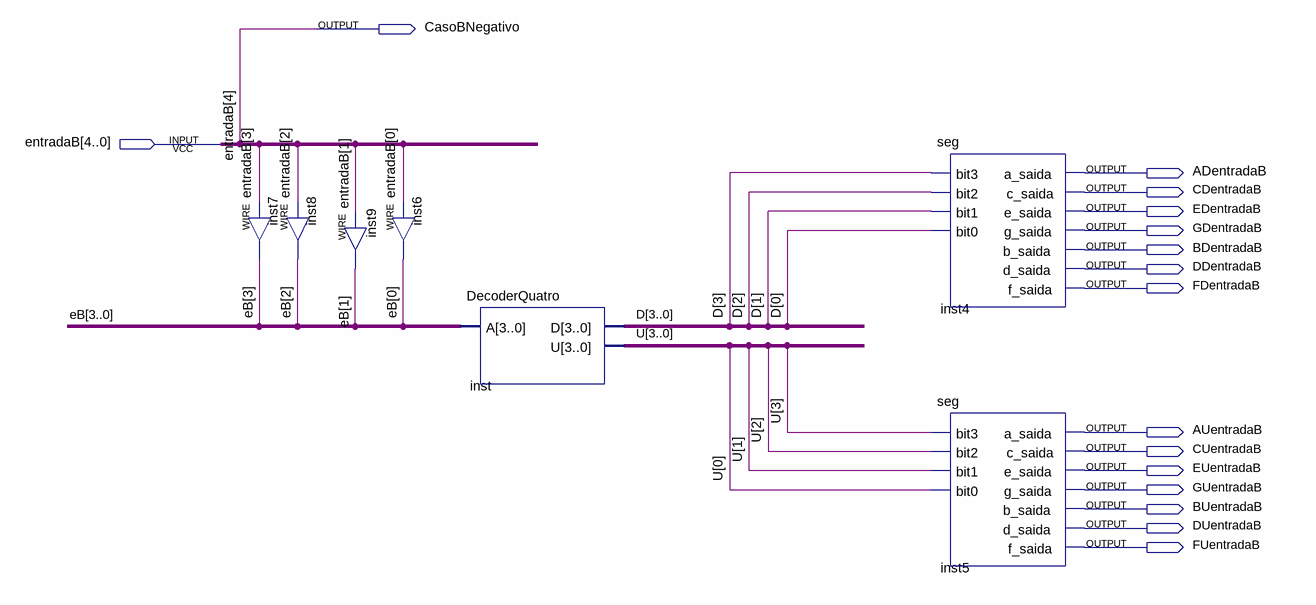
[diagram p0: schematic sheet]
// Quartus schematic EntradaB.bdf as structural Verilog: 7 symbols, 16 pins
module EntradaB (
  input  [4:0] entradaB,
  output CasoBNegativo,
  output ADentradaB,
  output CDentradaB,
  output EDentradaB,
  output GDentradaB,
  output BDentradaB,
  output DDentradaB,
  output FDentradaB,
  output AUentradaB,
  output CUentradaB,
  output EUentradaB,
  output GUentradaB,
  output BUentradaB,
  output DUentradaB,
  output FUentradaB
);

  wire [3:0] D, eB, U;

  assign eB[3] = entradaB[3];  // WIRE inst7
  assign eB[2] = entradaB[2];  // WIRE inst8
  assign eB[1] = entradaB[1];  // WIRE inst9
  assign eB[0] = entradaB[0];  // WIRE inst6
  DecoderQuatro inst (.A(eB), .D(D), .U(U));
  seg inst4 (
    .bit3(D[3]), .bit2(D[2]), .bit1(D[1]), .bit0(D[0]), .a_saida(ADentradaB), .c_saida(CDentradaB),
    .e_saida(EDentradaB), .g_saida(GDentradaB), .b_saida(BDentradaB), .d_saida(DDentradaB),
    .f_saida(FDentradaB));
  seg inst5 (
    .bit3(U[3]), .bit2(U[2]), .bit1(U[1]), .bit0(U[0]), .a_saida(AUentradaB), .c_saida(CUentradaB),
    .e_saida(EUentradaB), .g_saida(GUentradaB), .b_saida(BUentradaB), .d_saida(DUentradaB),
    .f_saida(FUentradaB));

  assign CasoBNegativo = entradaB[4];
endmodule
